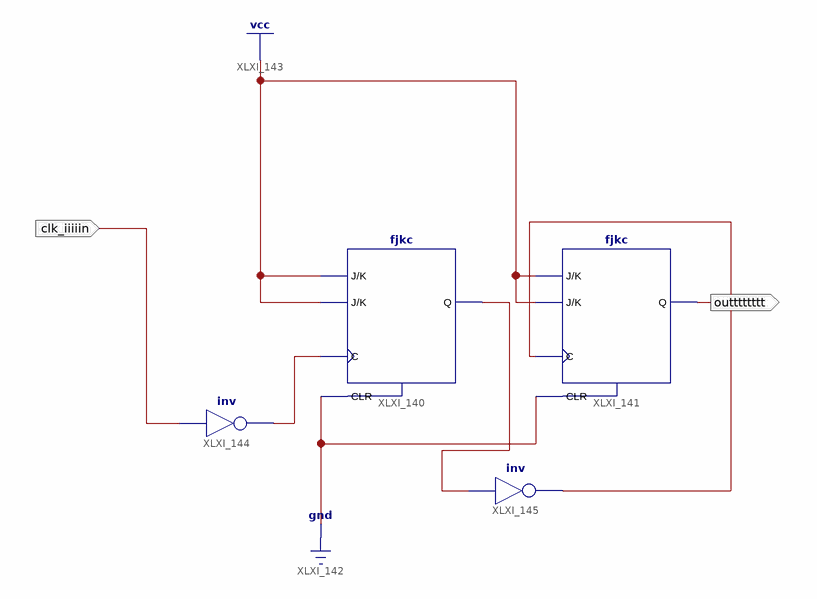
[diagram p0: schematic sheet 1]
// Xilinx ISE schematic clk_ii22ii.sch (spartan6) as structural Verilog: 4 symbols, 2 ports
module clk_ii22ii (
  input  clk_iiiiin,
  output outttttttt
);

  wire XLXN_190, XLXN_192, XLXN_193;

  fjkc XLXI_140 (.C(XLXN_190), .CLR(1'b0), .J(1'b1), .K(1'b1), .Q(XLXN_192));
  fjkc XLXI_141 (.C(XLXN_193), .CLR(1'b0), .J(1'b1), .K(1'b1), .Q(outttttttt));
  not XLXI_144 (XLXN_190, clk_iiiiin);
  not XLXI_145 (XLXN_193, XLXN_192);
endmodule
